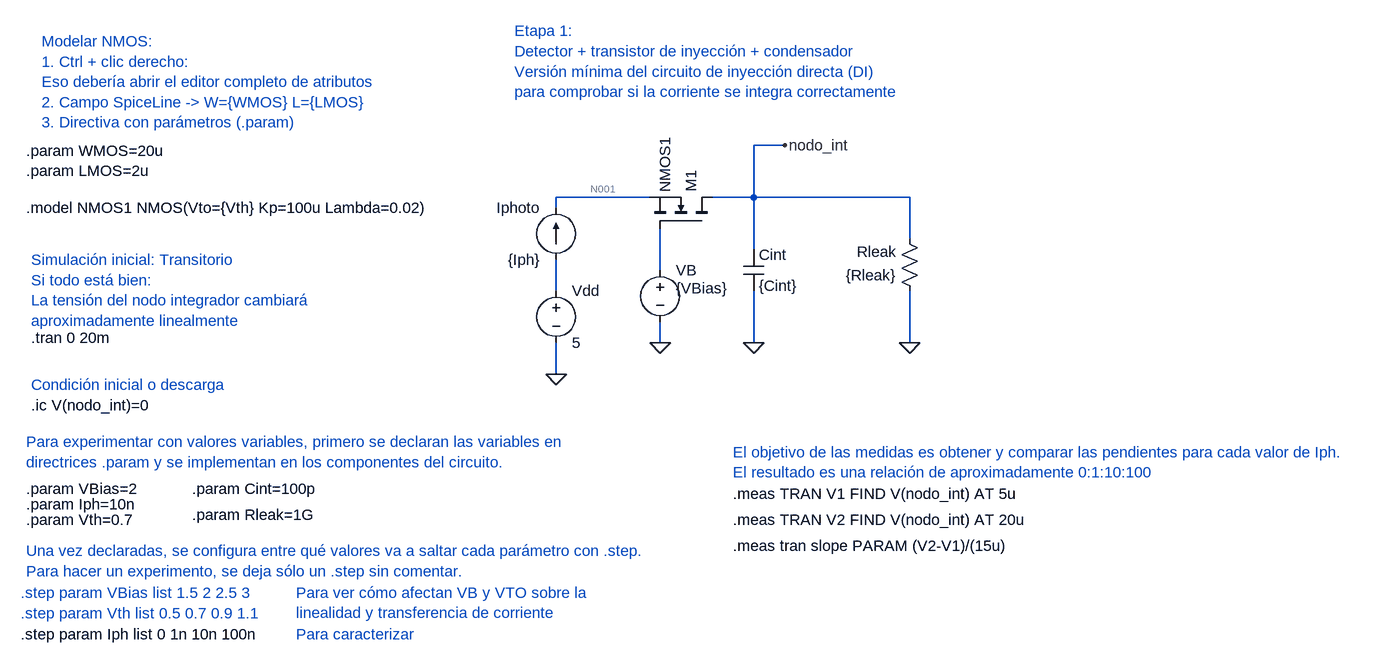
[diagram p0: schematic ID_Etapa1.asc]
ID_Etapa1.asc, the LTspice schematic file:
Version 4.1
SHEET 1 1592 784
WIRE -80 -16 -128 -16
WIRE -288 64 -432 64
WIRE -128 64 -128 -16
WIRE -128 64 -192 64
WIRE 112 64 -128 64
WIRE -432 80 -432 64
WIRE 112 128 112 64
WIRE -128 144 -128 64
WIRE -272 176 -272 112
WIRE -432 208 -432 160
WIRE -272 288 -272 256
WIRE -128 288 -128 208
WIRE 112 288 112 208
WIRE -432 336 -432 288
FLAG -128 288 0
FLAG -272 288 0
FLAG 112 288 0
FLAG -80 -16 nodo_int
FLAG -432 336 0
DATAFLAG -128 -16 ""
SYMBOL current -432 160 R180
WINDOW 0 24 80 Left 2
WINDOW 3 24 0 Left 2
SYMATTR InstName Iphoto
SYMATTR Value {Iph}
SYMBOL nmos -192 112 M270
SYMATTR InstName M1
SYMATTR Value NMOS1
SYMATTR SpiceLine W={WMOS} L={LMOS}
SYMBOL cap -144 144 R0
SYMATTR InstName Cint
SYMATTR Value {Cint}
SYMBOL voltage -272 160 R0
WINDOW 3 24 44 Left 2
SYMATTR Value {VBias}
SYMATTR InstName VB
SYMBOL res 128 224 R180
WINDOW 0 36 76 Left 2
WINDOW 3 36 40 Left 2
SYMATTR InstName Rleak
SYMATTR Value {Rleak}
SYMBOL voltage -432 192 R0
WINDOW 123 0 0 Left 0
WINDOW 39 0 0 Left 0
SYMATTR InstName Vdd
SYMATTR Value 5
TEXT -496 -192 Left 2 ;Etapa 1: \nDetector + transistor de inyección + condensador\nVersión mínima del circuito de inyección directa (DI)\npara comprobar si la corriente se integra correctamente
TEXT -1248 80 Left 2 !.model NMOS1 NMOS(Vto={Vth} Kp=100u Lambda=0.02)
TEXT -1248 -8 Left 2 !.param WMOS=20u\n.param LMOS=2u
TEXT -1224 -176 Left 2 ;Modelar NMOS:\n1. Ctrl + clic derecho: \nEso debería abrir el editor completo de atributos\n2. Campo SpiceLine -> W={WMOS} L={LMOS}\n3. Directiva con parámetros (.param)
TEXT -1240 280 Left 2 !.tran 0 20m
TEXT -1240 160 Left 2 ;Simulación inicial: Transitorio\nSi todo está bien:\nLa tensión del nodo integrador cambiará \naproximadamente linealmente
TEXT -1240 384 Left 2 !.ic V(nodo_int)=0
TEXT -1240 352 Left 2 ;Condición inicial o descarga
TEXT -1248 512 Left 2 !.param VBias=2
TEXT -1248 536 Left 2 !.param Iph=10n
TEXT -1248 560 Left 2 !.param Vth=0.7
TEXT -1248 440 Left 2 ;Para experimentar con valores variables, primero se declaran las variables en \ndirectrices .param y se implementan en los componentes del circuito.
TEXT -1248 608 Left 2 ;Una vez declaradas, se configura entre qué valores va a saltar cada parámetro con .step.\nPara hacer un experimento, se deja sólo un .step sin comentar.
TEXT -1256 672 Left 2 ;.step param VBias list 1.5 2 2.5 3
TEXT -1256 704 Left 2 ;.step param Vth list 0.5 0.7 0.9 1.1
TEXT -1256 736 Left 2 !.step param Iph list 0 1n 10n 100n
TEXT -992 512 Left 2 !.param Cint=100p
TEXT -992 552 Left 2 !.param Rleak=1G
TEXT -160 456 Left 2 ;El objetivo de las medidas es obtener y comparar las pendientes para cada valor de Iph. \nEl resultado es una relación de aproximadamente 0:1:10:100
TEXT -160 520 Left 2 !.meas TRAN V1 FIND V(nodo_int) AT 5u
TEXT -160 560 Left 2 !.meas TRAN V2 FIND V(nodo_int) AT 20u
TEXT -160 600 Left 2 !.meas tran slope PARAM (V2-V1)/(15u)
TEXT -832 672 Left 2 ;Para ver cómo afectan VB y VTO sobre la \nlinealidad y transferencia de corriente
TEXT -832 736 Left 2 ;Para caracterizar

The netlist it stands for:
* ID_Etapa1.asc
Iphoto N003 N001 {Iph}
M1 nodo_int N002 N001 N001 NMOS1 W={WMOS} L={LMOS}
Cint nodo_int 0 {Cint}
VB N002 0 {VBias}
Rleak 0 nodo_int {Rleak}
Vdd N003 0 5
.model NMOS NMOS
.model PMOS PMOS
.lib standard.mos
* Etapa 1:
* Detector + transistor de inyección + condensador
* Versión mínima del circuito de inyección directa (DI)
* para comprobar si la corriente se integra correctamente
.model NMOS1 NMOS(Vto={Vth} Kp=100u Lambda=0.02)
.param WMOS=20u
.param LMOS=2u
* Modelar NMOS:
* 1. Ctrl + clic derecho:
* Eso debería abrir el editor completo de atributos
* 2. Campo SpiceLine -> W={WMOS} L={LMOS}
* 3. Directiva con parámetros (.param)
.tran 0 20m
* Simulación inicial: Transitorio
* Si todo está bien:
* La tensión del nodo integrador cambiará
* aproximadamente linealmente
.ic V(nodo_int)=0
* Condición inicial o descarga
.param VBias=2
.param Iph=10n
.param Vth=0.7
* Para experimentar con valores variables, primero se declaran las variables en
* directrices .param y se implementan en los componentes del circuito.
* Una vez declaradas, se configura entre qué valores va a saltar cada parámetro con .step.
* Para hacer un experimento, se deja sólo un .step sin comentar.
* .step param VBias list 1.5 2 2.5 3
* .step param Vth list 0.5 0.7 0.9 1.1
.step param Iph list 0 1n 10n 100n
.param Cint=100p
.param Rleak=1G
* El objetivo de las medidas es obtener y comparar las pendientes para cada valor de Iph.
* El resultado es una relación de aproximadamente 0:1:10:100
.meas TRAN V1 FIND V(nodo_int) AT 5u
.meas TRAN V2 FIND V(nodo_int) AT 20u
.meas tran slope PARAM (V2-V1)/(15u)
* Para ver cómo afectan VB y VTO sobre la
* linealidad y transferencia de corriente
* Para caracterizar
.backanno
.end

* Results of the author's LTspice run, read from the files saved beside the schematic
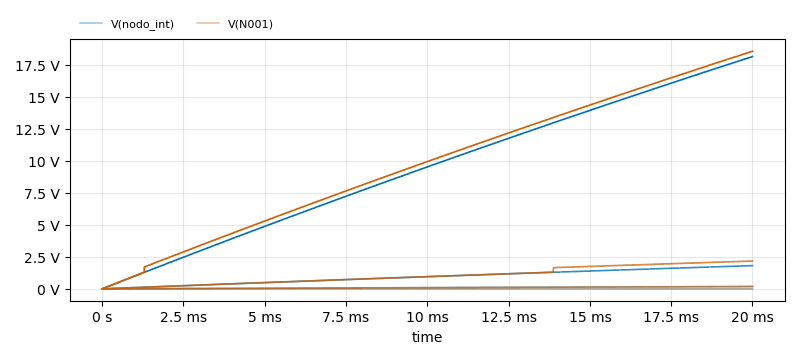
[diagram p1: Transient Analysis of ID_Etapa1.asc, plotted from the saved traces]
* Transient Analysis, 4 runs:
*   V(nodo_int) [iph=0]: min 0 V, max 0 V, average 0 V, rms 0 V, last 0 V
*   V(nodo_int) [iph=1e-09]: min 0 V, max 181.3 mV, average 93.65 mV, rms 107.3 mV, last 181.3 mV
*   V(nodo_int) [iph=1e-08]: min 0 V, max 1.813 V, average 936.5 mV, rms 1.073 V, last 1.813 V
*   V(nodo_int) [iph=1e-07]: min 0 V, max 18.13 V, average 9.365 V, rms 10.73 V, last 18.13 V
*   V(N001) [iph=0]: min -4.644e-07 fV, max 0 V, average 0 V, rms 3.245e-11 fV, last 0 V
*   V(N001) [iph=1e-09]: min 769.2 nV, max 181.3 mV, average 93.65 mV, rms 107.3 mV, last 181.3 mV
*   V(N001) [iph=1e-08]: min 7.692 µV, max 2.17 V, average 1.046 V, rms 1.237 V, last 2.17 V
*   V(N001) [iph=1e-07]: min 76.93 µV, max 18.54 V, average 9.755 V, rms 11.09 V, last 18.54 V
* From the log:
*   Measurement: v1
*     step  V(nodo_int)   at
*        1  0  5e-06
*        2  4.99986248156e-05  5e-06
*        3  0.000499986248156  5e-06
*        4  0.00499986251794  5e-06
*   Measurement: v2
*     step  V(nodo_int)   at
*        1  0  2e-05
*        2  0.000199977979201  2e-05
*        3  0.00199977985022  2e-05
*        4  0.0199977981384  2e-05
*   Measurement: slope
*     step  (V2-V1)/(15u)
*        1  0
*        2  9.9986236257
*        3  99.9862401375
*        4  999.862374696